# EAGLE design STM32F4 TFT-Proto Adapter (EAGLE 6.4)
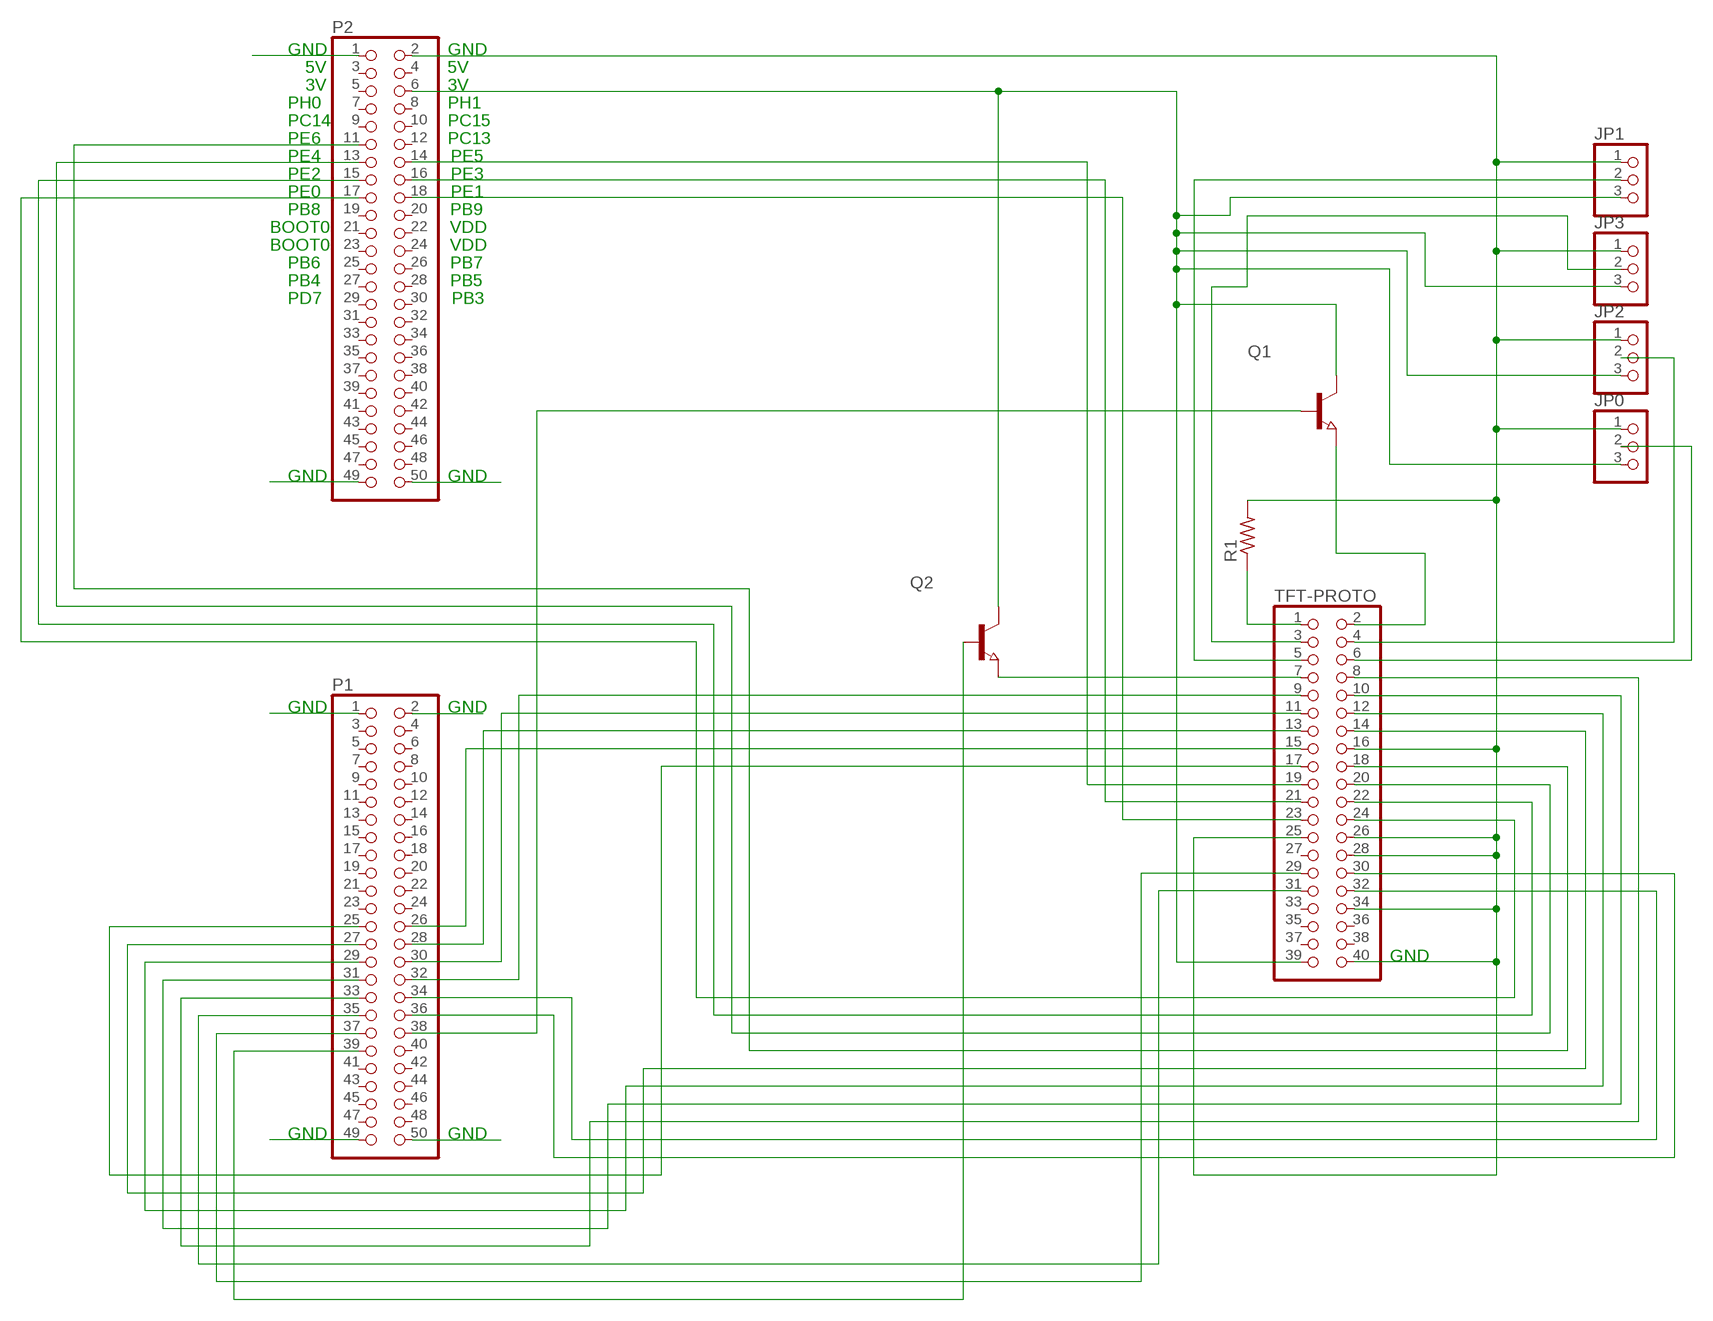
[diagram p0: schematic, sheet 1]

## Parts
JP0  PINHD-1X3  [1X03]
JP1  PINHD-1X3  [1X03]
JP2  PINHD-1X3  [1X03]
JP3  PINHD-1X3  [1X03]
P1  PINHD-2X25  [2X25]
P2  PINHD-2X25  [2X25]
Q1  NPN-TRANSISTOR_SOT23  [SOT23]
Q2  NPN-TRANSISTOR_SOT23  [SOT23]
R1  R-US_R0805  [R0805]
TFT-PROTO  PINHD-2X20  [2X20]

## Nets
CS: P1.34 TFT-PROTO.32
DAT1: P2.17 TFT-PROTO.24
DAT2: P2.18 TFT-PROTO.23
DAT3: P2.15 TFT-PROTO.22
DAT4: P2.16 TFT-PROTO.21
DAT5: P2.13 TFT-PROTO.20
DAT6: P2.14 TFT-PROTO.19
DAT7: P2.11 TFT-PROTO.18
DAT8: P1.25 TFT-PROTO.17
DAT10: P1.26 TFT-PROTO.15
DAT11: P1.27 TFT-PROTO.14
DAT12: P1.28 TFT-PROTO.13
DAT13: P1.29 TFT-PROTO.12
DAT14: P1.30 TFT-PROTO.11
DAT15: P1.31 TFT-PROTO.10
DAT16: P1.32 TFT-PROTO.9
DAT17: P1.33 TFT-PROTO.8
GND: JP0.1 JP1.1 JP2.1 JP3.1 P1.1 P1.2 P1.49 P1.50 P2.1 P2.2 P2.49 P2.50 R1.2 TFT-PROTO.16 TFT-PROTO.25 TFT-PROTO.26 TFT-PROTO.28 TFT-PROTO.34 TFT-PROTO.40
IM0: JP3.2 TFT-PROTO.3
IM1: JP0.2 TFT-PROTO.6
IM2: JP1.2 TFT-PROTO.5
IM3: JP2.2 TFT-PROTO.4
LEDA: P1.38 Q1.1(B)
N$3: R1.1 TFT-PROTO.1
N$4: Q1.2(E) TFT-PROTO.2
N$26: Q2.2(E) TFT-PROTO.7
PWR: JP0.3 JP1.3 JP2.3 JP3.3 P2.6 Q1.3(C) Q2.3(C) TFT-PROTO.39
RD: P1.37 TFT-PROTO.29
RS: P1.35 TFT-PROTO.31
RST: P1.39 Q2.1(B)
WR: P1.36 TFT-PROTO.30
Unconnected: P1.3 P1.4 P1.5 P1.6 P1.7 P1.8 P1.9 P1.10 P1.11 P1.12 P1.13 P1.14 P1.15 P1.16 P1.17 P1.18 P1.19 P1.20 P1.21 P1.22 P1.23 P1.24 P1.40 P1.41 P1.42 P1.43 P1.44 P1.45 P1.46 P1.47 P1.48 P2.3 P2.4 P2.5 P2.7 P2.8 P2.9 P2.10 P2.12 P2.19 P2.20 P2.21 P2.22 P2.23 P2.24 P2.25 P2.26 P2.27 P2.28 P2.29 P2.30 P2.31 P2.32 P2.33 P2.34 P2.35 P2.36 P2.37 P2.38 P2.39 P2.40 P2.41 P2.42 P2.43 P2.44 P2.45 P2.46 P2.47 P2.48 TFT-PROTO.27 TFT-PROTO.33 TFT-PROTO.35 TFT-PROTO.36 TFT-PROTO.37 TFT-PROTO.38

## Notes on the sheet
- GND | GND
- 5V | 5V
- 3V | 3V
- PH0 | PH1
- PC14 | PC15
- PE6 | PC13
- PE4                          PE5
- PE2                          PE3
- PE0                          PE1
- PB8                          PB9
- BOOT0                        VDD
- BOOT0                        VDD
- PB6                          PB7
- PB4                          PB5
- PD7                          PB3
- GND | GND
- GND | GND
- PE7
- GND
- GND | GND

## Library data of the parts
JP0 JP1-JP3 = pinhead:PINHD-1X3: PIN HEADER
P1 P2 = pinhead:PINHD-2X25: PIN HEADER
Q1 Q2 = semicon-smd-ipc:NPN-TRANSISTOR_: NPN TRANSISTOR
R1 = resistor:R-US_: RESISTOR, American symbol
TFT-PROTO = pinhead:PINHD-2X20: PIN HEADER

## Board
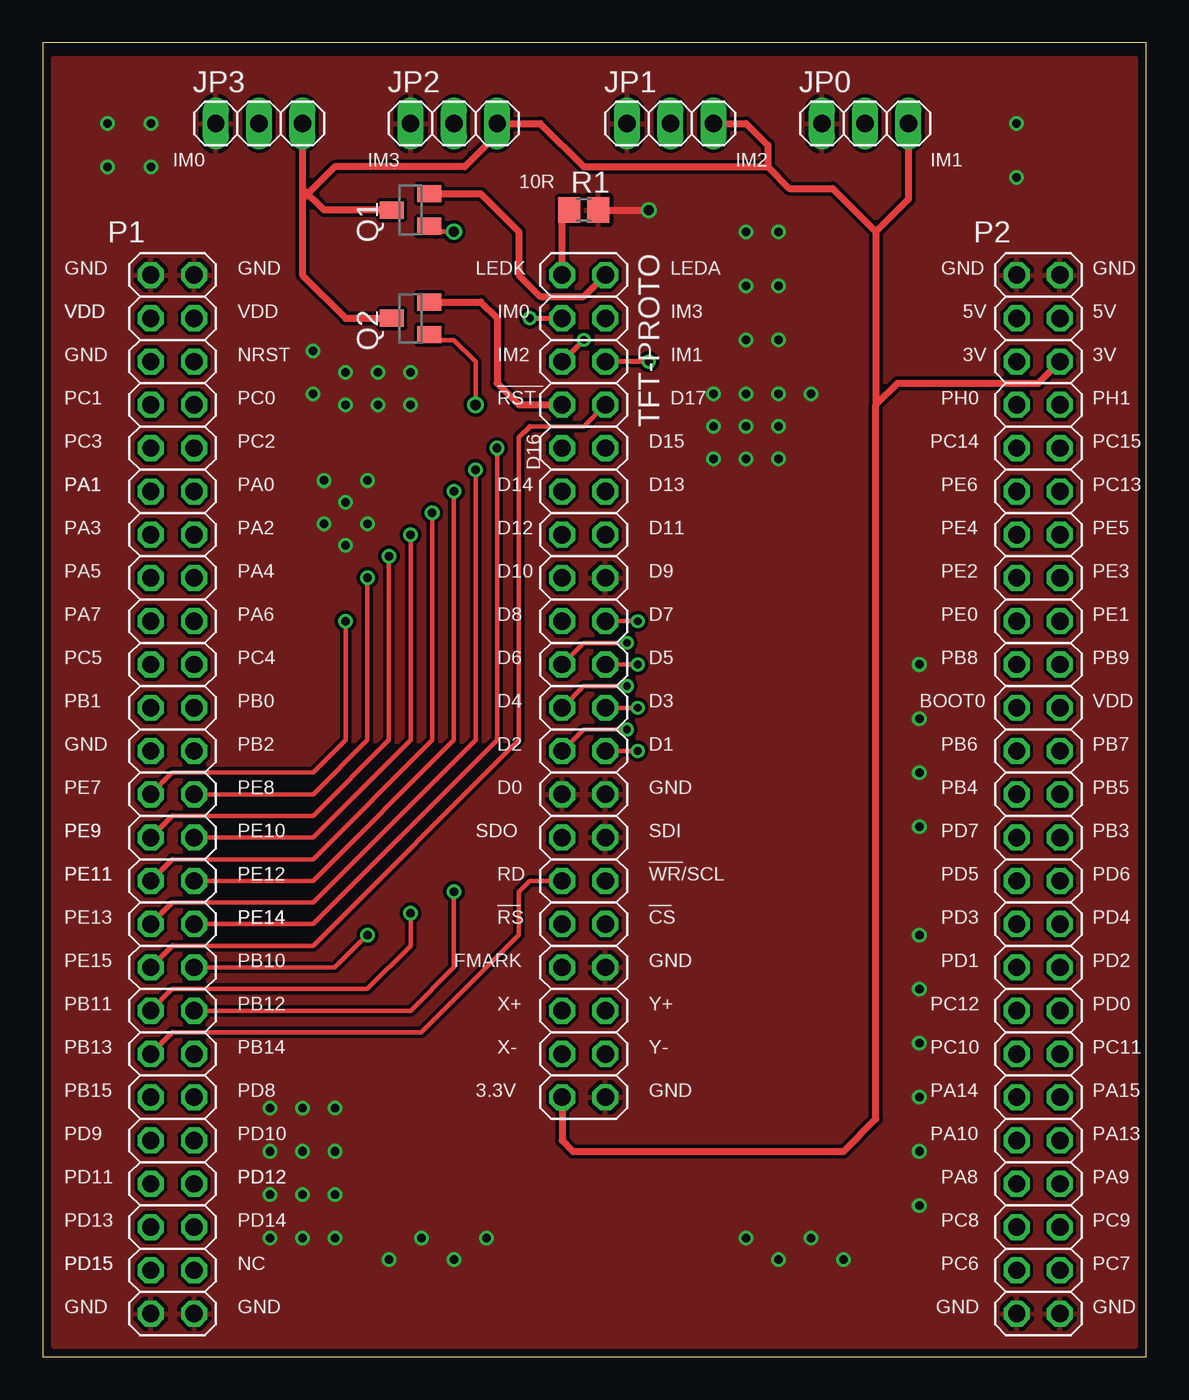
[diagram p1: board, top side]
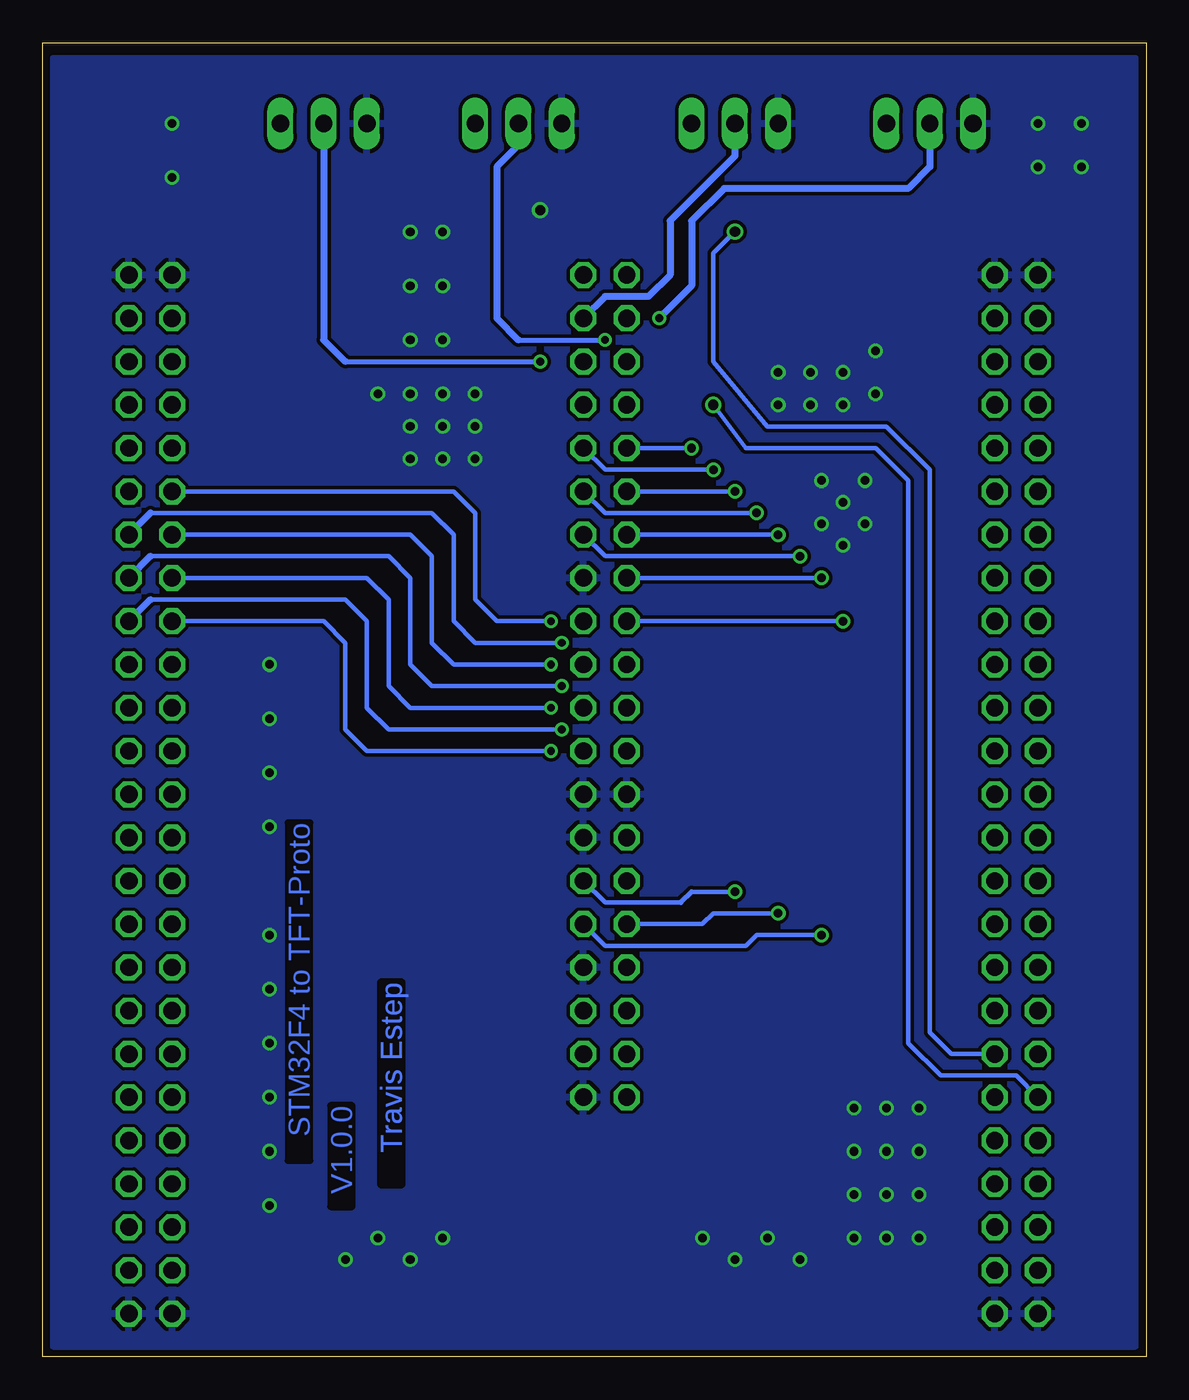
[diagram p2: board, bottom side, seen from below]

Size 64.75 x 77.14 mm. Coordinates in mm from the lower left corner, seen from the top.
Outline: 0,0 64.75,0 64.75,77.14 0,77.14 0,0
Copper layers (1*16): Top 0.0356mm / dielectric 1.5011mm / Bottom 0.0356mm
Design rules "LaenPCBOrder *": minimum track width 6mil, minimum drill 13mil, track to track 8mil, track to pad 8mil, pad to pad 8mil, via to via 8mil, smd to smd 8mil, copper to edge 15mil, drill to drill 6mil, minimum pad ring 7mil, minimum via ring 7mil, stop-mask expansion 4mil, vias tented up to drill 0mil, thermal gap 10mil

### Footprints (pad centres in the part's own frame; a part is rotated, then mirrored left to right if it is on the bottom)
1X03 = drill 1.016 long: 1 -2.54,0; 2 0,0; 3 2.54,0
2X25 = drill 1.016 octagon: 1 -30.48,-1.27; 2 -30.48,1.27; 3 -27.94,-1.27; 4 -27.94,1.27; 5 -25.4,-1.27; 6 -25.4,1.27; 7 -22.86,-1.27; 8 -22.86,1.27; 9 -20.32,-1.27; 10 -20.32,1.27; 11 -17.78,-1.27; 12 -17.78,1.27; 13 -15.24,-1.27; 14 -15.24,1.27; 15 -12.7,-1.27; 16 -12.7,1.27; 17 -10.16,-1.27; 18 -10.16,1.27; 19 -7.62,-1.27; 20 -7.62,1.27; 21 -5.08,-1.27; 22 -5.08,1.27; 23 -2.54,-1.27; 24 -2.54,1.27; 25 0,-1.27; 26 0,1.27; 27 2.54,-1.27; 28 2.54,1.27; 29 5.08,-1.27; 30 5.08,1.27; 31 7.62,-1.27; 32 7.62,1.27; 33 10.16,-1.27; 34 10.16,1.27; 35 12.7,-1.27; 36 12.7,1.27; 37 15.24,-1.27; 38 15.24,1.27; 39 17.78,-1.27; 40 17.78,1.27; 41 20.32,-1.27; 42 20.32,1.27; 43 22.86,-1.27; 44 22.86,1.27; 45 25.4,-1.27; 46 25.4,1.27; 47 27.94,-1.27; 48 27.94,1.27; 49 30.48,-1.27; 50 30.48,1.27
SOT23 = smd 1 x 1.4: 1 -0.95,-1.1; 2 0.95,-1.1; 3 0,1.1
R0805 = smd 1.3 x 1.5: 1 -0.85,0; 2 0.85,0
2X20 = drill 1.016 octagon: 1 -24.13,-1.27; 2 -24.13,1.27; 3 -21.59,-1.27; 4 -21.59,1.27; 5 -19.05,-1.27; 6 -19.05,1.27; 7 -16.51,-1.27; 8 -16.51,1.27; 9 -13.97,-1.27; 10 -13.97,1.27; 11 -11.43,-1.27; 12 -11.43,1.27; 13 -8.89,-1.27; 14 -8.89,1.27; 15 -6.35,-1.27; 16 -6.35,1.27; 17 -3.81,-1.27; 18 -3.81,1.27; 19 -1.27,-1.27; 20 -1.27,1.27; 21 1.27,-1.27; 22 1.27,1.27; 23 3.81,-1.27; 24 3.81,1.27; 25 6.35,-1.27; 26 6.35,1.27; 27 8.89,-1.27; 28 8.89,1.27; 29 11.43,-1.27; 30 11.43,1.27; 31 13.97,-1.27; 32 13.97,1.27; 33 16.51,-1.27; 34 16.51,1.27; 35 19.05,-1.27; 36 19.05,1.27; 37 21.59,-1.27; 38 21.59,1.27; 39 24.13,-1.27; 40 24.13,1.27

### Placement (x,y rotation side)
JP0  48.26,72.39 0 top
JP1  36.83,72.39 0 top
JP2  24.13,72.39 0 top
JP3  12.7,72.39 0 top
P1  7.62,33.02 270 top
P2  58.42,33.02 270 top
Q1  21.59,67.31 90 top
Q2  21.59,60.96 90 top
R1  31.75,67.31 0 top
TFT-PROTO  31.75,39.37 270 top

### Tracks (layer width: path | path; a pad name or v marks a point on that pad's centre or on a via)
CS  (via drill 0.5)
  Top 0.254: P1.34 17.14,22.86 v19.05,24.77
  Bottom 0.254: v19.05,24.77 22.86,24.77 23.49,24.13 31.75,24.13 TFT-PROTO.32
DAT1  (via drill 0.46)
  Top 0.254: v34.92,35.56 TFT-PROTO.24
  Bottom 0.254: P2.17 48.26,43.18 46.99,41.91 46.99,36.83 45.72,35.56 v34.92,35.56
DAT2  (via drill 0.46)
  Top 0.254: v34.29,36.83 31.75,36.83 TFT-PROTO.23
  Bottom 0.254: 58.42,44.45 46.99,44.45 45.72,43.18 45.72,38.1 44.45,36.83 v34.29,36.83
  Bottom 0.406: 58.42,44.45 P2.18
DAT3  (via drill 0.46)
  Top 0.254: v34.92,38.1 TFT-PROTO.22
  Bottom 0.254: P2.15 45.72,45.72 44.45,44.45 44.45,39.37 43.18,38.1 v34.92,38.1
DAT4  (via drill 0.46)
  Top 0.254: v34.29,39.37 31.75,39.37 TFT-PROTO.21
  Bottom 0.254: 58.42,46.99 44.45,46.99 43.18,45.72 43.18,40.64 41.91,39.37 v34.29,39.37
  Bottom 0.406: 58.42,46.99 P2.16
DAT5  (via drill 0.46)
  Top 0.254: v34.92,40.64 TFT-PROTO.20
  Bottom 0.254: P2.13 43.18,48.26 41.91,46.99 41.91,41.91 40.64,40.64 v34.92,40.64
DAT6  (via drill 0.46)
  Top 0.254: v34.29,41.91 31.75,41.91 TFT-PROTO.19
  Bottom 0.254: 58.42,49.53 41.91,49.53 40.64,48.26 40.64,43.18 39.37,41.91 v34.29,41.91
  Bottom 0.406: 58.42,49.53 P2.14
DAT7  (via drill 0.46)
  Top 0.254: v34.92,43.18 TFT-PROTO.18
  Bottom 0.254: P2.11 40.64,50.8 39.37,49.53 39.37,44.45 38.1,43.18 v34.92,43.18
DAT8  (via drill 0.5)
  Top 0.254: 7.62,34.29 15.88,34.29 17.78,36.2 v17.78,43.18
  Top 0.305: P1.25 7.62,34.29
  Bottom 0.254: v17.78,43.18 TFT-PROTO.17
DAT10  (via drill 0.5)
  Top 0.254: P1.26 15.88,33.02 19.05,36.2 v19.05,45.72
  Bottom 0.254: v19.05,45.72 TFT-PROTO.15
DAT11  (via drill 0.5)
  Top 0.254: 7.62,31.75 15.88,31.75 20.32,36.2 v20.32,46.99
  Top 0.305: P1.27 7.62,31.75
  Bottom 0.254: v20.32,46.99 31.75,46.99 TFT-PROTO.14
DAT12  (via drill 0.5)
  Top 0.254: P1.28 15.88,30.48 21.59,36.2 v21.59,48.26
  Bottom 0.254: v21.59,48.26 TFT-PROTO.13
DAT13  (via drill 0.5)
  Top 0.254: 7.62,29.21 15.88,29.21 22.86,36.2 v22.86,49.53
  Top 0.305: P1.29 7.62,29.21
  Bottom 0.254: v22.86,49.53 31.75,49.53 TFT-PROTO.12
DAT14  (via drill 0.5)
  Top 0.254: P1.30 15.88,27.94 24.13,36.2 v24.13,50.8
  Bottom 0.254: v24.13,50.8 TFT-PROTO.11
DAT15  (via drill 0.5)
  Top 0.254: 7.62,26.67 15.88,26.67 25.4,36.2 v25.4,52.07
  Top 0.305: P1.31 7.62,26.67
  Bottom 0.254: v25.4,52.07 31.75,52.07 TFT-PROTO.10
DAT16  (via drill 0.5)
  Top 0.254: P1.32 15.88,25.4 26.67,36.2 v26.67,53.34
  Bottom 0.254: v26.67,53.34 TFT-PROTO.9
DAT17
  Top 0.254: 7.62,24.13 15.88,24.13 27.94,36.2 27.94,53.98 | 28.57,54.61 31.75,54.61 TFT-PROTO.8
  Top 0.305: P1.33 7.62,24.13 | 27.94,53.98 28.57,54.61
GND  (via drill 0.5, 0.6)
  Top 0.406: R1.2 v35.56,67.31
  other vias: 3.81,72.39 3.81,69.85 6.35,69.85 6.35,72.39 43.18,66.04 43.18,62.87 57.15,72.39 57.15,69.22 20.32,5.71 22.22,6.99 24.13,5.71 26.04,6.99 41.28,6.99 43.18,5.71 45.09,6.99 46.99,5.71 41.28,62.87 43.18,59.69 41.28,59.69 41.28,66.04 43.18,56.52 41.28,56.52 51.44,40.64 51.44,37.47 51.44,34.29 51.44,31.11 51.44,24.77 51.44,21.59 51.44,18.41 51.44,15.24 51.44,12.06 51.44,8.89 17.78,55.88 17.78,47.62 19.68,55.88 19.05,48.9 21.59,55.88 19.05,51.44 15.88,56.52 15.88,59.05 17.78,57.78 19.68,57.78 21.59,57.78 13.34,14.61 13.34,12.06 13.34,9.53 13.34,6.99 15.24,6.99 17.14,6.99 15.24,9.53 17.14,9.53 15.24,12.06 17.14,12.06 15.24,14.61 17.14,14.61 17.78,50.16 16.51,48.9 16.51,51.44 43.18,52.7 43.18,54.61 41.28,52.7 41.28,54.61 45.09,56.52 39.37,52.7 39.37,54.61 39.37,56.52
  pour Bottom: 0.64,76.2 64.14,76.2 64.14,0.64 0.64,0.64
  pour Top: 0.64,76.2 0.64,0.64 64.14,0.64 64.14,76.2
IM0  (via drill 0.46)
  Top 0.305: v28.57,60.96 TFT-PROTO.3
  Bottom 0.406: JP3.2 12.7,69.85 13.97,68.58 24.76,68.58 26.67,66.67 26.67,62.87 v28.57,60.96
IM1  (via drill 0.46)
  Top 0.305: v35.56,58.42 TFT-PROTO.6
  Bottom 0.305: 46.99,58.42 v35.56,58.42
  Bottom 0.406: JP0.2 48.26,59.69 46.99,58.42
IM2  (via drill 0.46)
  Top 0.305: v31.75,59.69 TFT-PROTO.5
  Bottom 0.305: 36.83,59.69 v31.75,59.69
  Bottom 0.406: JP1.2 36.83,71.12 38.1,69.85 38.1,60.96 36.83,59.69
IM3
  Bottom 0.406: JP2.2 24.13,70.48 27.94,66.67 27.94,63.5 29.21,62.23 31.75,62.23 TFT-PROTO.4
LEDA  (via drill 0.6)
  Top 0.254: v24.13,66.04 23.01,66.04
  Top 0.406: 23.01,66.04 Q1.1
  Bottom 0.254: P1.38 11.43,17.78 12.7,19.05 12.7,52.07 15.24,54.61 22.22,54.61 25.4,58.42 25.4,64.77 v24.13,66.04
N$3
  Top 0.406: TFT-PROTO.1 30.48,66.89 R1.1
N$4
  Top 0.406: Q1.2 25.72,68.26 27.94,66.04 27.94,63.5 29.21,62.23 31.75,62.23 TFT-PROTO.2
N$26
  Top 0.406: Q2.2 25.72,61.91 26.67,60.96 26.67,57.15 27.94,55.88 TFT-PROTO.7
PWR
  Top 0.406: 20.32,67.31 Q1.3 16.51,67.31 15.24,68.58 | JP3.3 15.24,68.58 | 15.24,68.58 15.24,67.94 | 15.24,67.94 15.24,63.5 17.78,60.96 Q2.3 | TFT-PROTO.39 30.48,12.7 31.11,12.06 46.99,12.06 48.9,13.97 48.9,55.88 | 48.9,55.88 50.16,57.15 58.42,57.15 P2.6 | JP0.3 50.8,67.94 48.9,66.04 | 48.9,66.04 48.9,55.88 | JP1.3 41.28,72.39 42.55,71.12 42.55,69.85 | 42.55,69.85 43.82,68.58 46.36,68.58 48.9,66.04 | 42.55,69.85 31.75,69.85 29.21,72.39 JP2.3 26.67,71.75 24.76,69.85 17.14,69.85 15.24,67.94
RD
  Top 0.254: 7.62,19.05 22.22,19.05 27.94,24.77 27.94,27.3 28.57,27.94 TFT-PROTO.29
  Top 0.305: P1.37 7.62,19.05
RS  (via drill 0.5)
  Top 0.254: 7.62,21.59 19.05,21.59 21.59,24.13 v21.59,26.04
  Top 0.305: P1.35 7.62,21.59
  Bottom 0.254: v21.59,26.04 25.4,26.04 26.04,25.4 TFT-PROTO.31
RST  (via drill 0.6)
  Top 0.254: v25.4,55.88 25.4,58.42 24.13,59.69 23.01,59.69
  Top 0.406: 23.01,59.69 Q2.1
  Bottom 0.254: P1.39 7.62,16.51 12.07,16.51 13.97,18.41 13.97,51.44 15.88,53.34 23.49,53.34 v25.4,55.88
WR  (via drill 0.5)
  Top 0.254: P1.36 21.59,20.32 24.13,22.86 v24.13,27.3
  Bottom 0.254: v24.13,27.3 26.67,27.3 | 27.3,26.67 31.75,26.67 TFT-PROTO.30
  Bottom 0.305: 26.67,27.3 27.3,26.67

### Text on the board
Bottom: STM32F4 to TFT-Proto | Travis Estep | Travis Estep | Travis Estep | V1.0.0
tPlace: IM0 | IM3 | IM2 | IM1 | GND
tNames: 10R | GND | GND | LEDK | LEDA | GND | GND | VDD | VDD | VDD | IM0 | IM3 | 5V | 5V | GND | NRST | IM2 | IM1 | 3V | 3V | ____ | PC1 | PC0 | RST | D17 | PH0 | PH1 | PC3 | PC2 | D15 | PC14 | PC15 | D16 | PA1 | PA1 | PA0 | D14 | D13 | PE6 | PC13 | PA3 | PA2 | D12 | D11 | PE4 | PE5 | PA5 | PA4 | D10 | D9 | PE2 | PE3 | PA7 | PA6 | D8 | D7 | PE0 | PE1 | PC5 | PC4 | D6 | D5 | PB8 | PB9 | PB1 | PB0 | D4 | D3 | BOOT0 | VDD | GND | PB2 | D2 | D1 | PB6 | PB7 | PE7 | PE8 | D0 | GND | PB4 | PB5 | PE9 | PE9 | PE10 | SDO | SDI | PD7 | PB3 | ___ | PE11 | PE11 | PE12 | RD | WR/SCL | PD5 | PD6 | __ | __ | PE13 | PE14 | PE14 | RS | CS | PD3 | PD4 | PE15 | PB10 | FMARK | GND | PD1 | PD2 | PB11 | PB12 | X+ | Y+ | PC12 | PD0 | PB13 | PB14 | X- | Y- | PC10 | PC11 | PB15 | PD8 | 3.3V | PA14 | PA15 | PD9 | PD10 | PA10 | PA13 | PD11 | PD12 | PD12 | PA8 | PA9 | PD13 | PD14 | PC8 | PC9 | PD15 | PD15 | NC | PC6 | PC7 | GND | GND | GND | GND